# Altium schematic sheet CAN.SchDoc
size A4; SheetNumber: 4; SheetTotal: 6
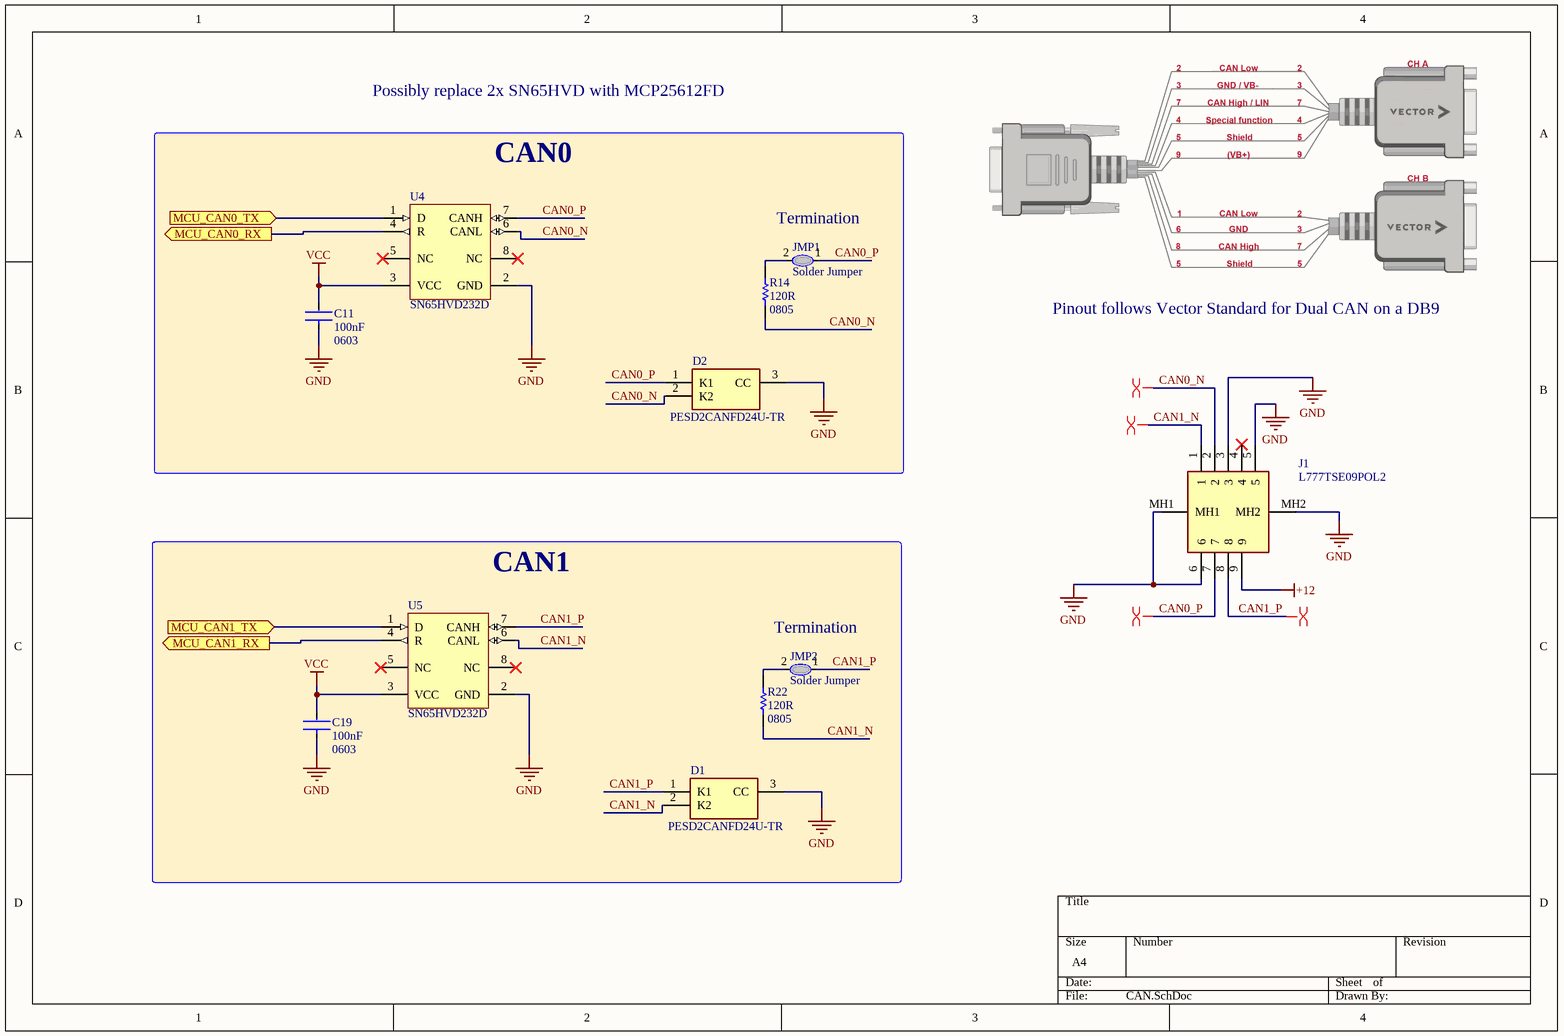
[diagram p0: CAN.SchDoc]

## Parts
C11  Capacitance: 100nF  Case/Package: 0603  [FP-CL10-IPC_A]  (hidden comment: CL10B104KB8WPNC)
C19  Capacitance: 100nF  Case/Package: 0603  [FP-CL10-IPC_A]  (hidden comment: CL10B104KB8WPNC)
D1  PESD2CANFD24U-TR  [SOT95P230X110-3N]
D2  PESD2CANFD24U-TR  [SOT95P230X110-3N]
J1  L777TSE09POL2  [L777TSE09POL2]
JMP1  Solder Jumper  [Solder Jumper]
JMP2  Solder Jumper  [Solder Jumper]
R14  Resistance: 120R  Package: 0805  [RESC2013X70X40LL20T20]  (hidden comment: ERJ-P06J121V)
R22  Resistance: 120R  Package: 0805  [RESC2013X70X40LL20T20]  (hidden comment: ERJ-P06J121V)
U4  SN65HVD232D  [D0008A_L]
U5  SN65HVD232D  [D0008A_L]

## Blocks framed on the sheet
CAN0: C11 D2 JMP1 R14 U4
CAN1: C19 D1 JMP2 R22 U5

## Ports
MCU_CAN0_RX (out), MCU_CAN0_TX (in), MCU_CAN1_RX (out), MCU_CAN1_TX (in)

## Nets
+12: J1.9
GND: C11.1 C19.1 D1.3(CC) D2.3(CC) J1.3 J1.5 J1.6 J1.MH1 J1.MH2 U4.2(GND) U5.2(GND)
VCC: C11.2 C19.2 U4.3(VCC) U5.3(VCC)
CAN0_N: D2.2(K2) J1.2 R14.2 U4.6(CANL)
CAN0_P: D2.1(K1) J1.7 JMP1.1 U4.7(CANH)
CAN1_N: D1.2(K2) J1.1 R22.2 U5.6(CANL)
CAN1_P: D1.1(K1) J1.8 JMP2.1 U5.7(CANH)
MCU_CAN0_RX: U4.4(R) ; port MCU_CAN0_RX
MCU_CAN0_TX: U4.1(D) ; port MCU_CAN0_TX
MCU_CAN1_RX: U5.4(R) ; port MCU_CAN1_RX
MCU_CAN1_TX: U5.1(D) ; port MCU_CAN1_TX
NetJMP1_2: JMP1.2 R14.1
NetJMP2_2: JMP2.2 R22.1

Not connected (* = marked no-connect by the designer): J1 4*; U4 5(NC)* 8(NC)*; U5 5(NC)* 8(NC)*

## Layout directives
differential pair: CAN0_N, CAN0_P, CAN1_N, CAN1_P

## Notes on the sheet
- Possibly replace 2x SN65HVD with MCP25612FD
- Termination
- Pinout follows Vector Standard for Dual CAN on a DB9

## Library data of the parts
C11 C19 = CMP-13271-002353-1: Cap Ceramic 100nF 50V X7R ±10% Pad SMD 0603 +125°C T/R; Ratings: AEC-Q200; Features: Soft Termination; Max Operating Temperature: 125°C; Mount: Surface Mount; Width: 0.031inch; Voltage Rating: 50V; Case Code (Metric): 1608; Case Code (Imperial): 0603; Tolerance: 10%; Min Operating Temperature: -55°C; Thickness: 0.035inch; Lead Free: Lead Free; Packaging: Tape and Reel; Length: 0.063inch
D1 D2 = PESD2CANFD24U-TR: Diode; Manufacturer_Name: Nexperia; Datasheet Link: https://assets.nexperia.com/documents/data-sheet/PESD2CANFD24U-T.pdf; Height: 1.1mm; Manufacturer_Part_Number: PESD2CANFD24U-TR; Mouser Part Number: 771-PESD2CANFD24U-TR; Mouser Price/Stock: https://www.mouser.co.uk/ProductDetail/Nexperia/PESD2CANFD24U-TR?qs=vmHwEFxEFR%252BPr2so13o7KA%3D%3D; Arrow Part Number: PESD2CANFD24U-TR; Arrow Price/Stock: https://www.arrow.com/en/products/pesd2canfd24u-tr/nexperia
J1 = L777TSE09POL2: Connector; Manufacturer_Name: Amphenol; Datasheet Link: https://cdn.amphenol-cs.com/media/wysiwyg/files/drawing/l777tsxxxpol2.pdf; Height: 12.22mm; Manufacturer_Part_Number: L777TSE09POL2; Mouser Part Number: 523-L777TSE09POL2; Mouser Price/Stock: https://www.mouser.co.uk/ProductDetail/Amphenol-Commercial-Products/L777TSE09POL2?qs=8nwx9VzGl4xjIfY3UQTpgw%3D%3D
R14 R22 = CMP-2001-00481-1: Manufacturer: Panasonic; Part Number: ERJ-P06J121V
U4 U5 = CMP-0315-00073-2: 3.3 V CAN Transceiver, 17 mA, -40 to 85 degC, 8-pin SOIC (D), Green (RoHS & no Sb/Br); Manufacturer: Texas Instruments; Supply Voltage(s)(V): 3.3; Transient Pulse Protection(V): -25 to 25; ICC(Max)(mA): 17; Drivers Per Package: 1; Rating: Catalog; Code_JEDEC: MS-012AA; Mounting Technology: Surface Mount; PackageDescription: 8-Pin Plastic Small Outline Integrated Circuit, 4.9 x 3.9 mm, Pitch 1.27 mm Pitch; SubFamily: CAN; PackageVersion: revM, Jun-2011; Isolated: No; DatasheetVersion: SLOS346K; PackageReference: D0008A; Receivers Per Package: 1; Footprint: SN65HVD232; ComponentLink1Description: Datasheet; PartNumber: SN65HVD232D; Eco-Plan: Green (RoHS & no Sb/Br); ComponentLink1URL: http://www.ti.com/general/docs/lit/getliterature.tsp?genericPartNumber=SN65HVD232&fileType=pdf